# EAGLE schematic sFPI-Photodiode-Amplifier (EAGLE 7.3.0)
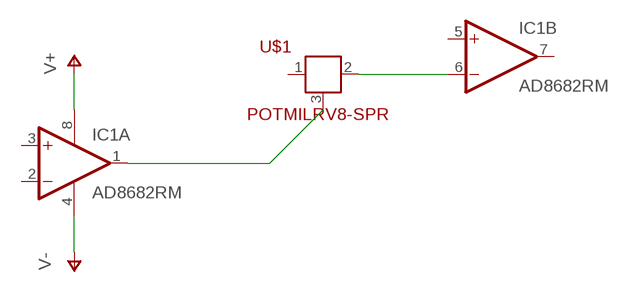
[diagram p0: schematic, sheet 1]

## Parts
IC1  AD8682RM  [MSOP08]
U$1  POTMILRV8-SPR  [SPR]

## Nets
N$1: IC1.1(A:OUT) U$1.3
N$2: IC1.6(B:-IN) U$1.2
V+: IC1.8(P:V+)
V-: IC1.4(P:V-)
Unconnected: IC1.2(A:-IN) IC1.3(A:+IN) IC1.5(B:+IN) IC1.7(B:OUT) U$1.1

## Library data of the parts
IC1 = linear:AD8682: Dual Low Power, High Speed JFET Operational Amplifiers Source: http://www.analog.com/UploadedFiles/Data_Sheets/AD8682_8684.pdf
U$1 = sFPI:POTMILRV8: Precision series SPR/RV8 potentiometers are for PCB applications requiring a rugged potentiometer.